# Altium schematic sheet Blend VCO.SchDoc
size A3; SheetNumber: 3; SheetTotal: 4
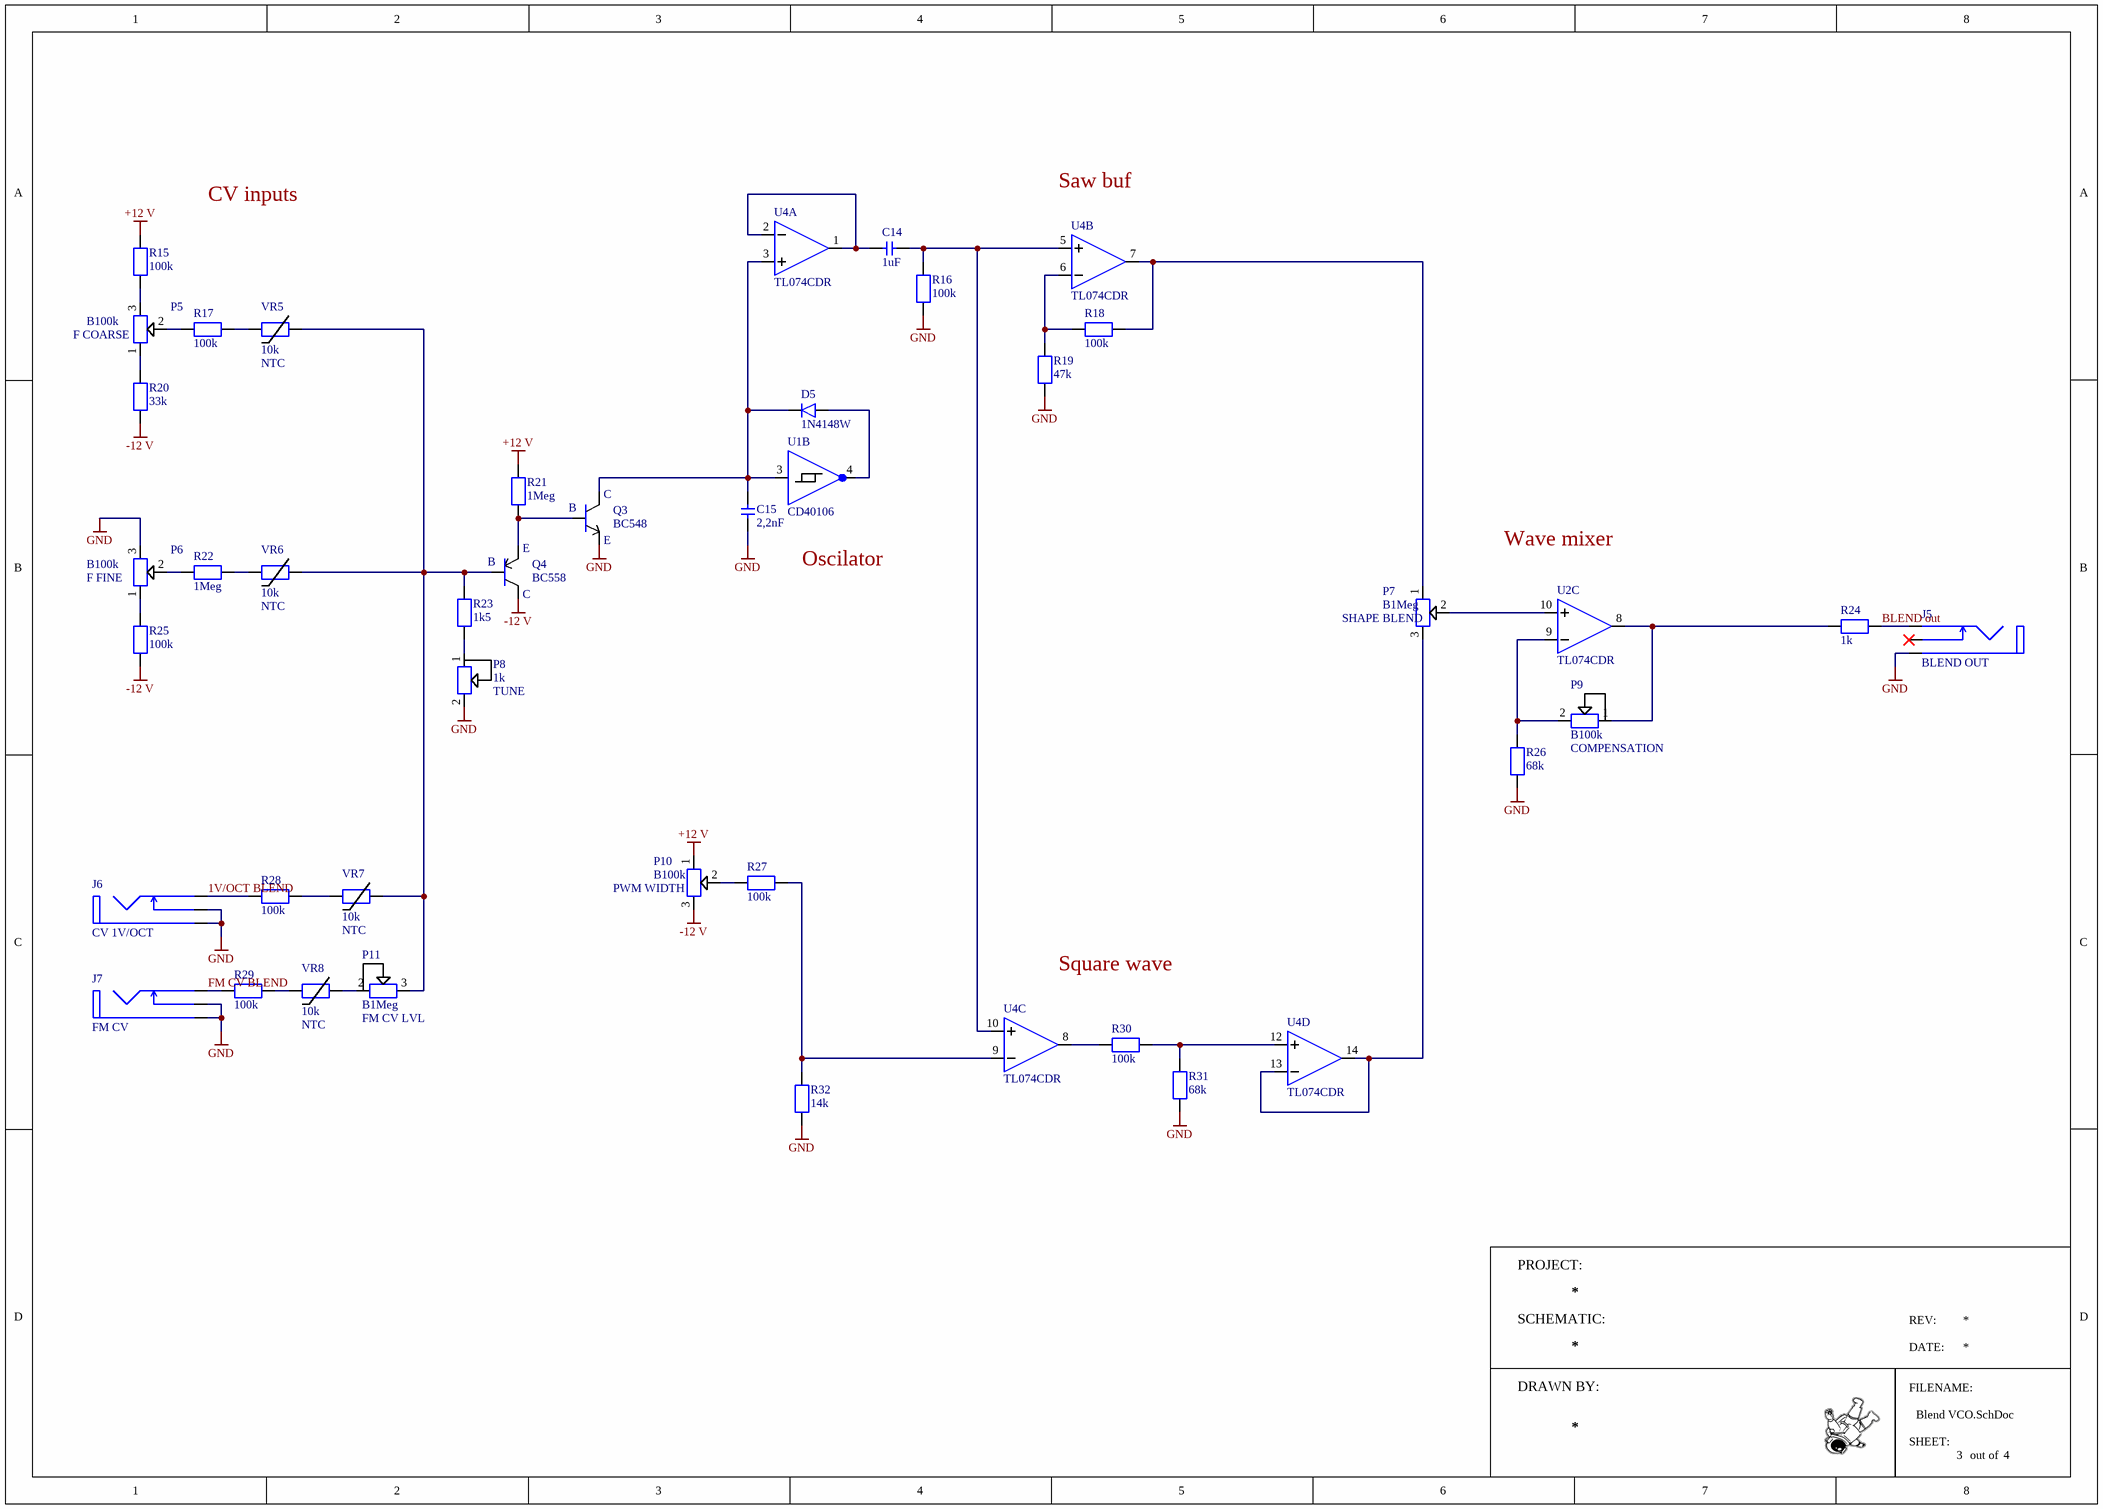
[diagram p0: Blend VCO.SchDoc]

## Parts
C14  value 1uF  [Cap SMD 0805]  (hidden comment: CAP)
C15  value 2,2nF  [Cap SMD 0805]  (hidden comment: CAP)
D5  Model: 1N4148W  [SOD-123]  (hidden comment: DIODE)
J5  Label: BLEND OUT  [PJ301M]  (hidden comment: JACK Mono)
J6  Label: CV 1V/OCT  [PJ301M]  (hidden comment: JACK Mono)
J7  Label: FM CV  [PJ301M]  (hidden comment: JACK Mono)
P5  value B100k  Parameter: F COARSE  [9 mm PCB Potentiometer]  (hidden comment: Mono Pot)
P6  value B100k  Parameter: F FINE  [9 mm PCB Potentiometer]  (hidden comment: Mono Pot)
P7  value B1Meg  Parameter: SHAPE BLEND  [9 mm PCB Potentiometer]  (hidden comment: Mono Pot)
P8  value 1k  Parameter: TUNE  [Multiturn Potentiometer inline]  (hidden comment: VR)
P9  value B100k  Parameter: COMPENSATION  [9 mm PCB Potentiometer]  (hidden comment: VR)
P10  value B100k  Parameter: PWM WIDTH  [9 mm PCB Potentiometer]  (hidden comment: Mono Pot)
P11  value B1Meg  Parameter: FM CV LVL  [9 mm PCB Potentiometer]  (hidden comment: VR)
Q3  BC548  [TO-92 wide]
Q4  BC558  [TO-92 wide]
R15  value 100k  [Resistor SMD 0805]  (hidden comment: RES)
R16  value 100k  [Resistor SMD 0805]  (hidden comment: RES)
R17  value 100k  [Resistor SMD 0805]  (hidden comment: RES)
R18  value 100k  [Resistor SMD 0805]  (hidden comment: RES)
R19  value 47k  [Resistor SMD 0805]  (hidden comment: RES)
R20  value 33k  [Resistor SMD 0805]  (hidden comment: RES)
R21  value 1Meg  [Resistor SMD 0805]  (hidden comment: RES)
R22  value 1Meg  [Resistor SMD 0805]  (hidden comment: RES)
R23  value 1k5  [Resistor SMD 0805]  (hidden comment: RES)
R24  value 1k  [Resistor SMD 0805]  (hidden comment: RES)
R25  value 100k  [Resistor SMD 0805]  (hidden comment: RES)
R26  value 68k  [Resistor SMD 0805]  (hidden comment: RES)
R27  value 100k  [Resistor SMD 0805]  (hidden comment: RES)
R28  value 100k  [Resistor SMD 0805]  (hidden comment: RES)
R29  value 100k  [Resistor SMD 0805]  (hidden comment: RES)
R30  value 100k  [Resistor SMD 0805]  (hidden comment: RES)
R31  value 68k  [Resistor SMD 0805]  (hidden comment: RES)
R32  value 14k  [Resistor SMD 0805]  (hidden comment: RES)
U1  CD40106  [DIP-14 socket]  (part B of 7)
U2  TL074CDR  [SOIC14]  (part C of 5)
U4  TL074CDR  [SOIC14]  (parts A,B,C,D of 5)
VR5  NTC  value 10k  [Thermistor SMD 0805]
VR6  NTC  value 10k  [Thermistor SMD 0805]
VR7  NTC  value 10k  [Thermistor SMD 0805]
VR8  NTC  value 10k  [Thermistor SMD 0805]

## Nets
+12 V: P10.1 R15.2 R21.1
-12 V: P10.3 Q4.1 R20.1 R25.1
GND: C15.1 J5.1 J6.1 J6.2 J7.1 J7.2 P6.3 P8.2 Q3.3 R16.2 R19.2 R26.1 R31.1 R32.1
1V/OCT BLEND: J6.3 R28.2
BLEND out: J5.3 R24.2
FM CV BLEND: J7.3 R29.2
NetC14_1: C14.1 R16.1 U4.5 U4.10
NetC14_2: C14.2 U4.1 U4.2
NetC15_2: C15.2 D5.2 Q3.1 U1.3 U4.3
NetD5_1: D5.1 U1.4
NetP5_1: P5.1 R20.2
NetP5_2: P5.2 R17.2
NetP5_3: P5.3 R15.1
NetP6_1: P6.1 R25.2
NetP6_2: P6.2 R22.2
NetP7_1: P7.1 R18.2 U4.7
NetP7_2: P7.2 U2.10
NetP7_3: P7.3 U4.13 U4.14
NetP8_1: P8.1 R23.2
NetP9_1: P9.1 R24.1 U2.8
NetP9_2: P9.2 R26.2 U2.9
NetP10_2: P10.2 R27.1
NetP11_2: P11.2 VR8.2
NetP11_3: P11.3 Q4.2 R23.1 VR5.2 VR6.2 VR7.2
NetQ3_2: Q3.2 Q4.3 R21.2
NetR17_1: R17.1 VR5.1
NetR18_1: R18.1 R19.1 U4.6
NetR22_1: R22.1 VR6.1
NetR27_2: R27.2 R32.2 U4.9
NetR28_1: R28.1 VR7.1
NetR29_1: R29.1 VR8.1
NetR30_1: R30.1 U4.8
NetR30_2: R30.2 R31.2 U4.12

Not connected (* = marked no-connect by the designer): J5 2*

## Notes on the sheet
- CV inputs
- Saw buf
- Oscilator
- Wave mixer
- Square wave
- PROJECT:
- SCHEMATIC:
- REV:
- DRAWN BY:
- DATE:
- FILENAME:
- SHEET:
- out of
- (in symbol BC548) C; B; E
- (in symbol BC558) E; B; C

## Library data of the parts
C14 C15 = Capacitor SMD 0805: SMD Capacitor Non-Polarised 0805 Package; Voltage rating: *; Tolerance: *; Package Type: SMD
D5 = Diode SMD SOD123: Generic SMD Diode SOD123 Package; Max reverse voltage: *; Max current: *; Forward voltage: *; Package Type: SMD; Type: Diode
J5-J7 = PJ301M: PJ301M Eurorack 3,5 mm Patch Socket PCB Mount; Package Type: THT
P5-P7 P10 = Potentiometer 9 mm: PCB Mount 9mm Mono Potentiometer THT; Taper: *; Package Type: THT; Type: Potentiometer
P8 = VR A Multiturn THT: PCB Mount Multiturn Trimmer Potentiometer Top Adjustable as Variable Resistor Clockwise Increase; Taper: *; Package Type: THT; Type: Potentiometer
P9 = VR A 9 mm: PCB Mount 9mm Mono Potentiometer THT as Variable Resistor Clockwise Increase; Taper: *; Package Type: THT; Type: Potentiometer
P11 = VR B 9 mm: PCB Mount 9mm Mono Potentiometer THT as Variable Resistor Clockwise Decrease; Taper: *; Package Type: THT; Type: Potentiometer
Q3 = BC548: BC548 NPN Transistor THT TO-92 Package; Package Type: THT; Type: NPN Transistor; Package: TO-92; Group: *
Q4 = BC558: BC558 PNP Transistor THT TO-92 Package; Package Type: THT; Type: PNP Transistor; Package: TO-92; Group: *
R15-R32 = Resistor SMD 0805: SMD Resistor 0805 package; Tolerance: *; Package Type: SMD
U1 = CD40106 DIP-14: CD40106 Hex Schmitt Trigger Inverter DIP-14 Package; Type: Schmitt Trigger; Package Type: THT; Package: DIP-14
U2 U4 = TL074CDR SOIC14: TL074CDR Quad Op-Amp SOIC14 Package; Type: Op Amp; Package Type: SMD; Package: SOIC14
VR5-VR8 = Thermistor NTC SMD 0805: SMD NTC Thermistor 0805 package; Tolerance: *; Package Type: SMD